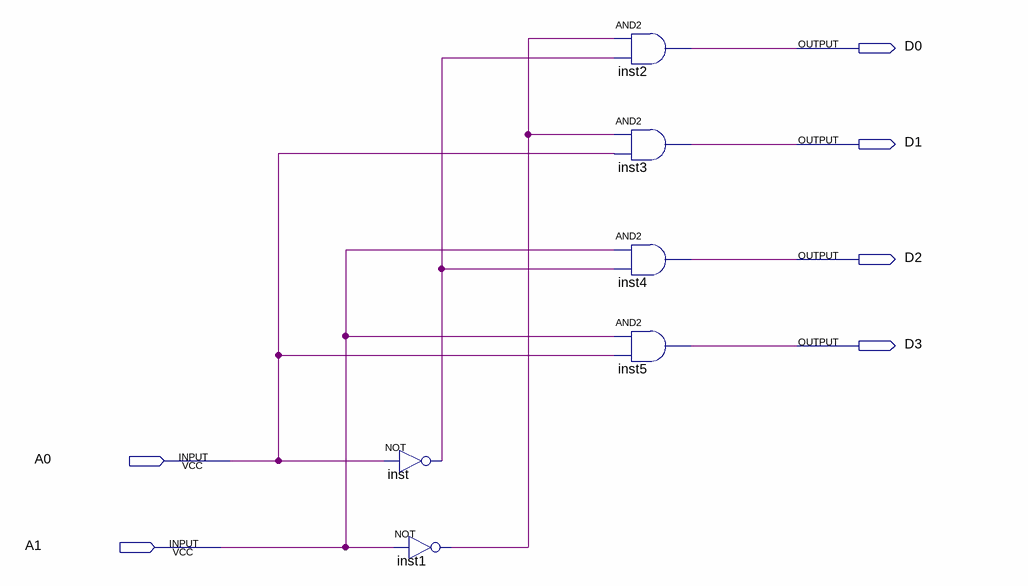
[diagram p0: schematic sheet]
// Quartus schematic Decoder2to4.bdf as structural Verilog: 6 symbols, 6 pins
module Decoder2to4 (
  input  A0,
  input  A1,
  output D0,
  output D1,
  output D2,
  output D3
);

  wire inst1_out, inst_out;

  not inst (inst_out, A0);
  not inst1 (inst1_out, A1);
  and inst2 (D0, inst1_out, inst_out);
  and inst3 (D1, inst1_out, A0);
  and inst4 (D2, A1, inst_out);
  and inst5 (D3, A1, A0);
endmodule
